# EAGLE design Zio LiPo Battery Manager (EAGLE 8.7.1)
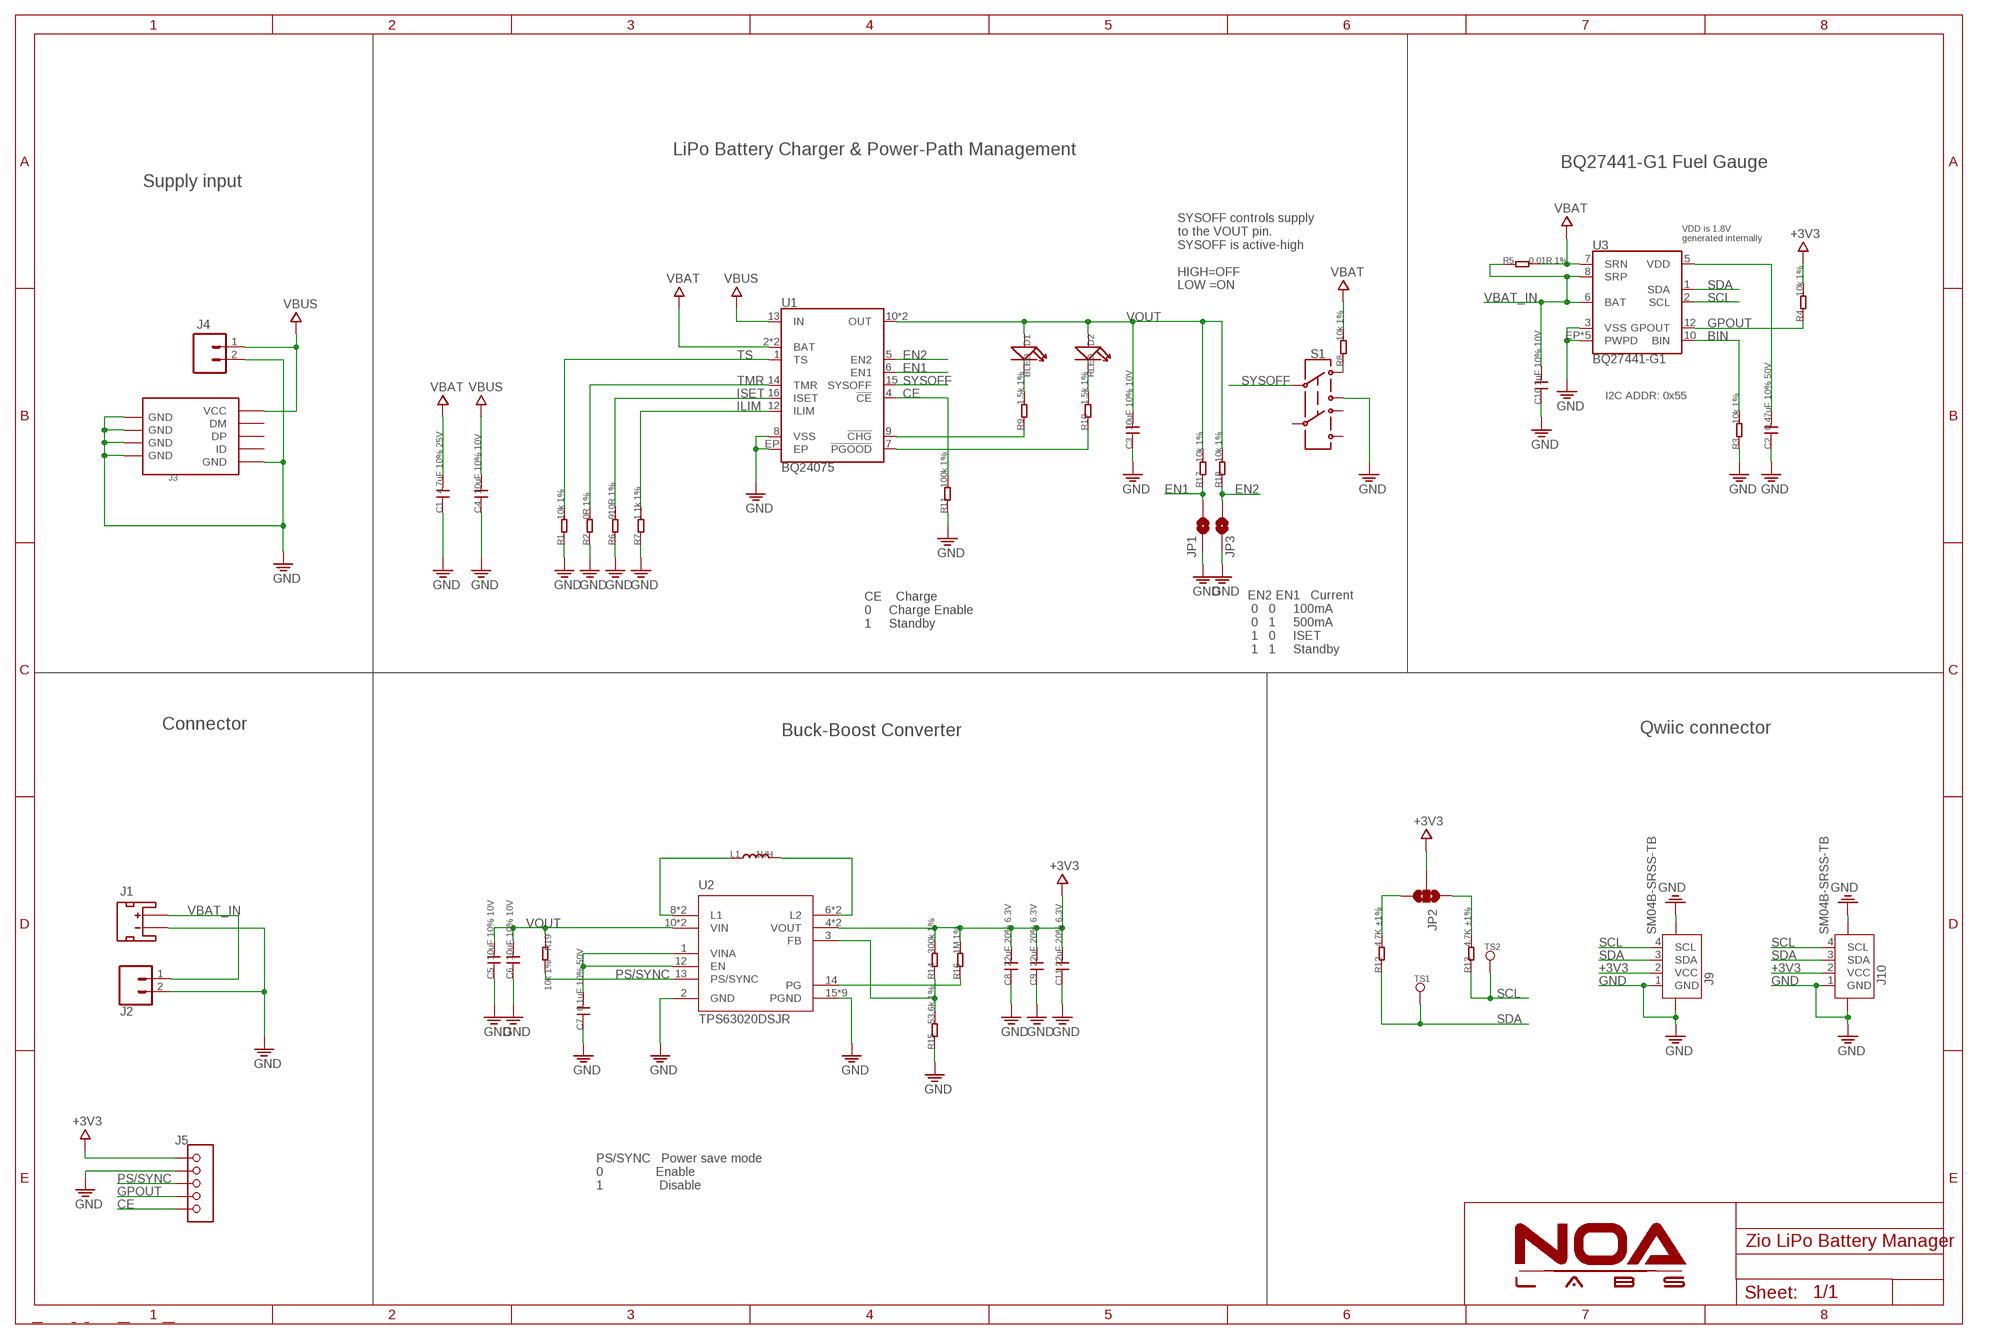
[diagram p0: schematic, sheet 1]

## Parts
C1  4.7uF 10% 25V  C-0603  [0603]
C2  0.47uF 10% 50V  C-0603  [0603]
C3  10uF 10% 10V  C-0805  [0805]
C4  10uF 10% 10V  C-0805  [0805]
C5  10uF 10% 10V  C-0805  [0805]
C6  10uF 10% 10V  C-0805  [0805]
C7  0.1uF 10% 50V  C-0603  [0603]
C8  22uF 20% 6.3V  C-0805  [0805]
C9  22uF 20% 6.3V  C-0805  [0805]
C10  1uF 10% 10V  C-0603  [0603]
C11  22uF 20% 6.3V  C-0805  [0805]
D1  BLED  LED'0603'  [LED-0603]
D2  RLED  LED'0603'  [LED-0603]
J1  JST_2MM_MALE  [JST-2-SMD]
J2  CONN_02  [1X02]
J3  USB-MICROE  [MICRO-SMD]
J4  CONN_02  [1X02]
J5  HEADER-5P-2.54  [5P-2.54]
J9  SM04B-SRSS-TB  JST-SH-4P-1.0  [JST-SH-4P]
J10  SM04B-SRSS-TB  JST-SH-4P-1.0  [JST-SH-4P]
JP1  JUMPER-SMT_2_NC_PASTE_NOCREM  [SMT-JUMPER_2_NC_PASTE_SILK_NOCREM]
JP2  JUMPER-SMT_3_2-NC_PASTE_NOCREM  [SMT-JUMPER_3_2-NC_PASTE_SILK_NOCREM]
JP3  JUMPER-SMT_2_NC_PASTE_NOCREM  [SMT-JUMPER_2_NC_PASTE_SILK_NOCREM]
L1  1UH  L-0420M  [0420M]
R1  10k 1%  R-0603  [0603]
R2  0R 1%  R-0603  [0603]
R3  10k 1%  R-0603  [0603]
R4  10k 1%  R-0603  [0603]
R5  0.01R 1%  R-1206  [1206]
R6  910R 1%  R-0603  [0603]
R7  1.1k 1%  R-0603  [0603]
R8  10k 1%  R-0603  [0603]
R9  1.5k 1%  R-0603  [0603]
R10  1.5k 1%  R-0603  [0603]
R11  100k 1%  R-0603  [0603]
R12  4.7K ±1%  R-0603  [0603]
R13  4.7K ±1%  R-0603  [0603]
R14  300k 1%  R-0603  [0603]
R15  53.6k 1%  R-0603  [0603]
R16  1M 1%  R-0603  [0603]
R17  10k 1%  R-0603  [0603]
R18  10k 1%  R-0603  [0603]
R19  10k 1%  R-0603  [0603]
S1  SWITCH-DPDT-SMD-AYZ0202  [SWITCH_DPDT_SMD_AYZ0202]
TS1  TEST_POINT35MIL  [1P-35MIL]
TS2  TEST_POINT35MIL  [1P-35MIL]
U1  BQ24075  [PVQFN-N16]
U2  TPS63020DSJR  [VSON-14]
U3  BQ27441-G1  [PDSO-N12]

## Nets
1.8V: C2.2 U3.5(VDD)
+3V3: C8.2 C9.2 C11.2 J5.1 J9.2(VCC) J10.2(VCC) JP2.2 R4.2 R14.2 R16.2 U2.4(VOUT) U2.5(VOUT)
BIN: R3.2 U3.10(BIN)
CE: J5.5 R11.2 U1.4(!CE!)
EN1: JP1.2 R17.1 U1.6(EN1)
EN2: JP3.2 R18.1 U1.5(EN2)
GND: C1.1 C2.1 C3.1 C4.1 C5.1 C6.1 C7.1 C8.1 C9.1 C10.1 C11.1 J1.1(-) J2.2 J3.GND J3.S1(GND) J3.S1@1(GND) J3.S1@2(GND) J3.S2(GND) J3.S2@1(GND) J3.S2@2(GND) J3.S3(GND) J3.S3@1(GND) J3.S3@2(GND) J3.S4(GND) J3.S4@1(GND) J3.S4@2(GND) J4.2 J5.2 J9.1(GND) J9.NC1 J9.NC2 J10.1(GND) J10.NC1 J10.NC2 JP1.1 JP3.1 R1.1 R2.1 R3.1 R6.1 R7.1 R11.1 R15.1 S1.3 U1.8(VSS) U1.EP U2.2(GND) U2.15(PGND) U2.16(PGND) U2.17(PGND) U2.18(PGND) U2.19(PGND) U2.20(PGND) U2.21(PGND) U2.22(PGND) U2.23(PGND) U3.3(VSS) U3.EP1(PWPD) U3.EP2(PWPD) U3.EP3(PWPD) U3.EP4(PWPD) U3.EP(PWPD)
GPOUT: J5.4 R4.1 U3.12(GPOUT)
ILIM: R7.2 U1.12(ILIM)
ISET: R6.2 U1.16(ISET)
N$3: JP2.3 R12.2
N$7: C7.2 U2.1(VINA) U2.12(EN)
N$8: R8.1 S1.1
N$9: R9.1 U1.9(!CHG!)
N$10: R14.1 R15.2 U2.3(FB)
N$11: D1.- R9.2
N$12: JP2.1 R13.2
N$13: R10.1 U1.7(!PGOOD!)
N$14: D2.- R10.2
N$16: L1.1 U2.8(L1) U2.9(L1)
N$18: L1.2 U2.6(L2) U2.7(L2)
PG: R16.1 U2.14(PG)
PS/SYNC: J5.3 R19.2 U2.13(PS/SYNC)
SCL: J9.4(SCL) J10.4(SCL) R13.1 TS2.P$1 U3.2(SCL)
SDA: J9.3(SDA) J10.3(SDA) R12.1 TS1.P$1 U3.1(SDA)
SYSOFF: S1.2 U1.15(SYSOFF)
TMR: R2.2 U1.14(TMR)
TS: R1.2 U1.1(TS)
VBAT: C1.2 R5.2 R8.2 U1.2(BAT) U1.3(BAT) U3.7(SRN)
VBAT_IN: C10.2 J1.2(+) J2.1 R5.1 U3.6(BAT) U3.8(SRP)
VBUS: C4.2 J3.VBUS(VCC) J4.1 U1.13(IN)
VOUT: C3.2 C5.2 C6.2 D1.+ D2.+ R17.2 R18.2 R19.1 U1.10(OUT) U1.11(OUT) U2.10(VIN) U2.11(VIN)
Unconnected: J1.NC1(PAD1) J1.NC2(PAD2) J3.D+(DP) J3.D-(DM) J3.ID S1.4 S1.5 S1.6

## Notes on the sheet
- LiPo Battery Charger & Power-Path Management
- BQ27441-G1 Fuel Gauge
- Supply input
- VDD is 1.8V
  generated internally
- SYSOFF controls supply 
  to the VOUT pin.
  SYSOFF is active-high
  
  HIGH=OFF
  LOW =ON
- I2C ADDR: 0x55
- CE    Charge
  0     Charge Enable
  1     Standby
- EN2 EN1   Current
   0   0     100mA
   0   1     500mA
   1   0     ISET
   1   1     Standby
- Connector | Qwiic connector
- Buck-Boost Converter
- PS/SYNC   Power save mode
  0               Enable
  1                Disable

## Library data of the parts
C1-C11 = Discretex:C*: Ceramic Capacitors
D1 D2 = Discretex:LED*
J1 = SparkFun-Connectors:JST_2MM_MALE: JST 2MM MALE RA CONNECTOR Two pin, compact surface mount connector. Commonly used as a battery input connection point. We really like the solid locking feeling and high current rating on these small connectors. We use these all the time as battery connectors. Mates to single-cell LiPo batteries. Here is the connector we sell at SparkFun: JST Right Angle Connector - White <https://www.sparkfun.com/products/8612> (PRT-08612) Datasheet <http://www.sparkfun.com/datasheets/Prototyping/Connectors/JST-Horizontal.pdf> It was used on these SparkFun products: SparkFun MOSFET Power Controller <https://www.sparkfun.com/products/11214> (PRT-11214) SparkFun Battery Babysitter - LiPo Battery Manager <https://www.sparkfun.com/products/13777> (PRT-13777) And many, many others that required a lipo battery connection.; DIGIKEY: https://www.digikey.com/product-detail/en/jst-sales-america-inc/S2B-PH-SM4-TB-LF-SN/455-1749-1-ND/926846; PROD_ID: CONN-11443; SF_ID: PRT-08612
J2 J4 = SparkFun-Connectors:CONN_02: Multi connection point. Often used as Generic Header-pin footprint for 0.1 inch spaced/style header connections On any of the 0.1 inch spaced packages, you can populate with these: Break Away Headers - Straight <https://www.sparkfun.com/products/116> (PRT-00116) Break Away Male Headers - Right Angle <https://www.sparkfun.com/products/553> (PRT-00553) Female Headers <https://www.sparkfun.com/products/115> (PRT-00115) Break Away Headers - Machine Pin <https://www.sparkfun.com/products/117> (PRT-00117) Break Away Female Headers - Swiss Machine Pin <https://www.sparkfun.com/products/743> (PRT-00743) For SCREWTERMINALS and SPRING TERMINALS visit here: Screw Terimnals on SparkFun.com <https://www.sparkfun.com/search/results?term=Screw+Terminals> (5mm/3.5mm/2.54mm spacing) This device is also useful as a general connection point to wire up your design to another part of your project. Our various solder wires solder well into these plated through hole pads. Hook-Up Wire - Assortment (Stranded, 22 AWG) <https://www.sparkfun.com/products/11375> (PRT-11375) Hook-Up Wire - Assortment (Solid Core, 22 AWG) <https://www.sparkfun.com/products/11367> (PRT-11367) View the entire wire category on our website here <https://www.sparkfun.com/categories/141> Special notes: Molex polarized connector foot print use with: PRT-08233 with associated crimp pins and housings. 2.54_SCREWTERM for use with PRT-10571. 3.5mm Screw Terminal footprints for PRT-08084 5mm Screw Terminal footprints for use with PRT-08432
J3 = Connector:USB-MICROE
J5 = Connector:HEADER-5P
J9 J10 = Connector:JST-SH-4P
JP1 JP3 = NOA-Jumpers:JUMPER-SMT_2_NC_PASTE_NOCREM
JP2 = NOA-Jumpers:JUMPER-SMT_3_2-NC_PASTE_NOCREM
L1 = Discretex:L*
R1-R19 = Discretex:R*
S1 = SparkFun-Switches:SWITCH-DPDT: Double-Pole, Double-Throw (DPDT) Switch Double-pole, double-throw switches. Variant Overview PTH-GPI-152-3013 Used on SparkFun Geiger Counter <https://www.sparkfun.com/products/11345> SMD-AY0202 Surface Mount DPDT Switch <https://www.sparkfun.com/products/597> (COM-00597) Used on e.g. LilyPad Arduino USB - ATmega32U4 Board <https://www.sparkfun.com/products/12049>; DIGIKEY: https://www.digikey.com/product-detail/en/c-k/AYZ0202AGRLC/401-2013-1-ND/1640122; PROD_ID: SWCH-08179; SF_SKU: COM-00597
TS1 TS2 = Connector:TEST_POINT
U1 = battery-management-temp:BQ24075; PROD_ID: IC-13219
U2 = IC:TPS63020DSJR
U3 = IC:BQ27441-G1

## Board
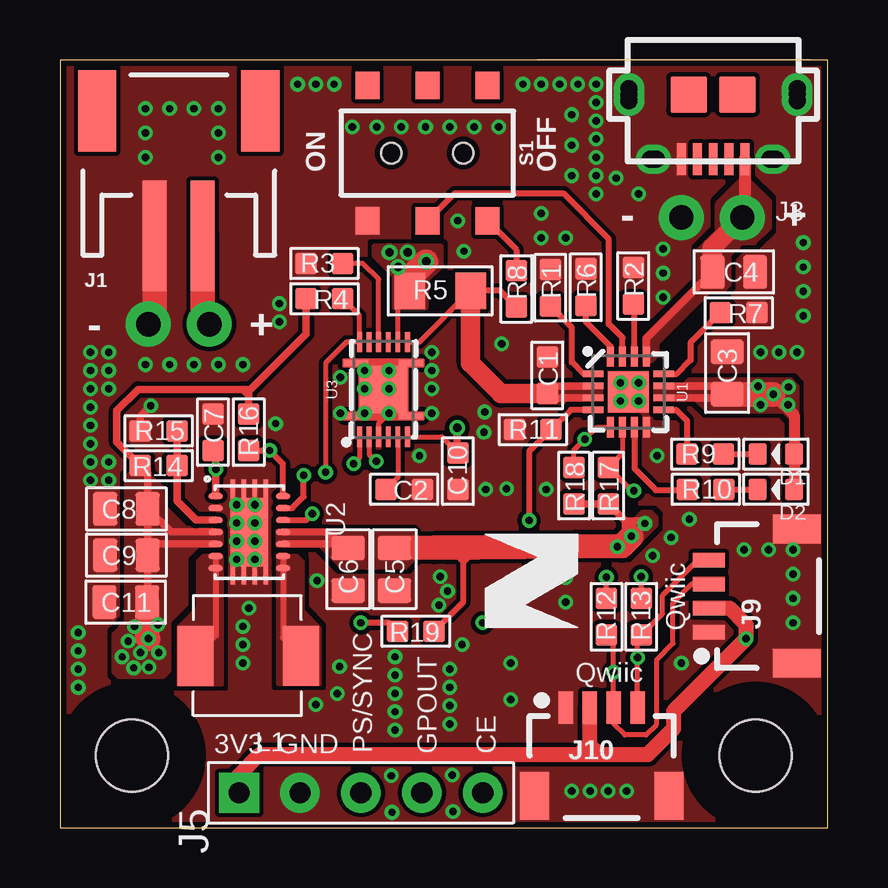
[diagram p1: board, top side]
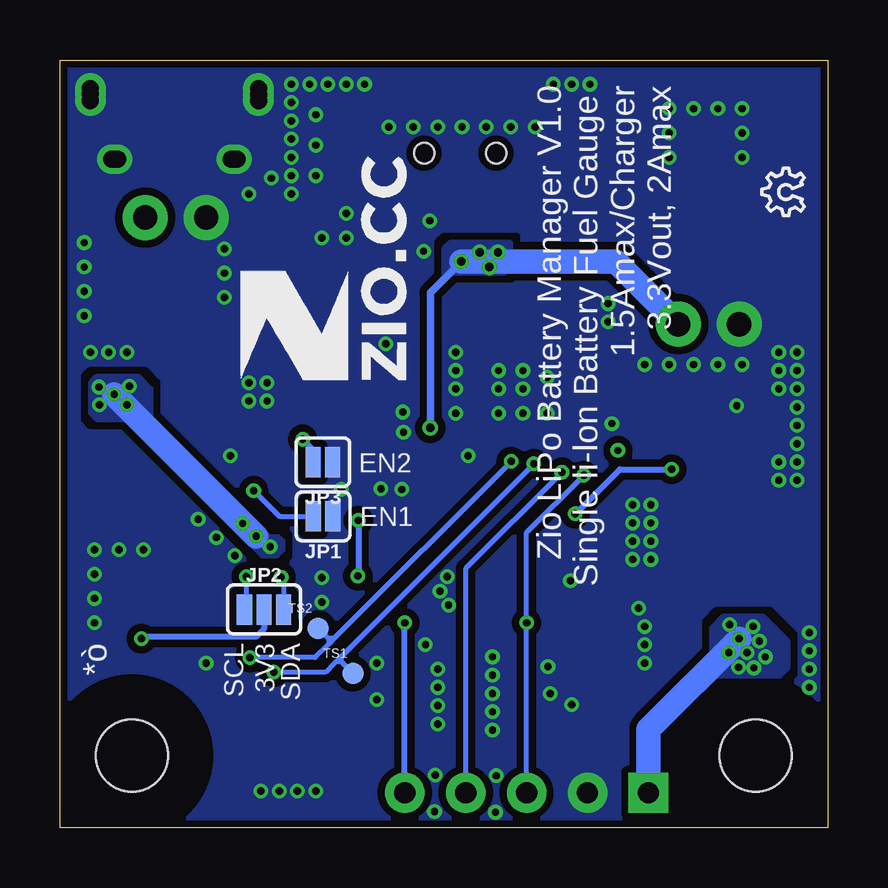
[diagram p2: board, bottom side, seen from below]

Size 32 x 32 mm. Coordinates in mm from the lower left corner, seen from the top.
Outline: 0,0 32,0 32,32 0,32 0,0
Copper layers (1*16): Top 0.035mm / dielectric 1.5mm / Bottom 0.035mm
Design rules "NOA Eagle Rule *": minimum track width 6mil, minimum drill 0.29971875mm, track to track 7mil, track to pad 7mil, pad to pad 7mil, via to via 7mil, smd to smd 0mil, copper to edge 10mil, drill to drill 10mil, minimum pad ring 10mil, minimum via ring 6mil, stop-mask expansion 2mil, vias tented up to drill 25mil, thermal gap 10mil
Holes 3 mm at 3,3 29,3
tRestrict: area 0,0 to 6,6; area 26,0 to 32,6
bRestrict: area 0,0 to 6,6; area 26,0 to 32,6

### Footprints (pad centres in the part's own frame; a part is rotated, then mirrored left to right if it is on the bottom)
0603 = smd 0.889 x 0.889: 1 -0.762,0; 2 0.762,0
0805 = smd 1.016 x 1.397: 1 -0.889,0; 2 0.889,0
LED-0603 = smd 0.762 x 0.889: + -0.762,0; - 0.762,0
JST-2-SMD = smd 1 x 4.6: 1 -1,-3.7; 2 1,-3.7 | smd 1.6 x 3.4: NC1 -3.4,1.5; NC2 3.4,1.5
1X02 = drill 1.016 pad 1.88: 1 0,0; 2 2.54,0
MICRO-SMD = smd 0.406 x 1.346: D+ 0,2.057; D- -0.66,2.057; GND 1.321,2.057; ID 0.66,2.057; VBUS -1.321,2.057 | drill 0.7: S1 -2.489,2.057; S1@1 -2.616,2.057; S1@2 -2.362,2.057; S2 2.464,2.057; S2@1 2.362,2.057; S2@2 2.616,2.057 | drill 0.7 pad 1.27: S3 -3.505,-0.66; S3@1 -3.505,-0.381; S3@2 -3.505,-0.889; S4 3.505,-0.635; S4@1 3.505,-0.381; S4@2 3.505,-0.889 | smd 1.524 x 1.524: S5 -1.016,-0.635; S6 1.016,-0.635
5P-2.54 = drill 0.889 pad 1.651 square: 1 0,5.08 | drill 0.889 pad 1.651: 2 0,2.54; 3 0,0; 4 0,-2.54; 5 0,-5.08
JST-SH-4P = smd 0.6 x 1.35: 1 1.5,0; 2 0.5,0; 3 -0.5,0; 4 -1.5,0 | smd 1.2 x 2: NC1 -2.8,3.675; NC2 2.8,3.675
SMT-JUMPER_2_NC_PASTE_SILK_NOCREM = smd 0.635 x 1.27: 1 -0.406,0; 2 0.406,0
SMT-JUMPER_3_2-NC_PASTE_SILK_NOCREM = smd 0.635 x 1.27: 1 -0.813,0; 2 0,0; 3 0.813,0
0420M = smd 1.5 x 2.5: 1 0,0; 2 4.4,0
1206 = smd 1.27 x 1.524: 1 -1.27,0; 2 1.27,0
SWITCH_DPDT_SMD_AYZ0202 = smd 1 x 1.15: 1 -2.5,2.825; 2 0,2.825; 3 2.5,2.825; 4 -2.5,-2.825; 5 0,-2.825; 6 2.5,-2.825 | hole 0.85: 1.5,0; -1.5,0
1P-35MIL = smd 0.889 x 0.889: P$1 0,0
PVQFN-N16 = smd 0.28 x 0.85: 1 -0.75,-1.475; 2 -0.25,-1.475; 3 0.25,-1.475; 4 0.75,-1.475; 9 0.75,1.475; 10 0.25,1.475; 11 -0.25,1.475; 12 -0.75,1.475 | smd 0.85 x 0.28: 5 1.475,-0.75; 6 1.475,-0.25; 7 1.475,0.25; 8 1.475,0.75; 13 -1.475,0.75; 14 -1.475,0.25; 15 -1.475,-0.25; 16 -1.475,-0.75 | smd 1.7 x 1.7: EP 0,0
VSON-14 = smd 0.24 x 0.6: 1 -1.5,-1.4; 2 -1,-1.4; 3 -0.5,-1.4; 4 0,-1.4; 5 0.5,-1.4; 6 1,-1.4; 7 1.5,-1.4; 8 1.5,1.4; 9 1,1.4; 10 0.5,1.4; 11 0,1.4; 12 -0.5,1.4; 13 -1,1.4; 14 -1.5,1.4 | smd 2.85 x 1.58: 15 0,0 | smd 0.775 x 0.2: 16 -1.8,0.69; 17 -1.8,0.23; 18 -1.8,-0.23; 19 -1.8,-0.69; 20 1.8,-0.69; 21 1.8,-0.23; 22 1.8,0.23; 23 1.8,0.69
PDSO-N12 = smd 0.2 x 0.85: 1 -1,-1.975; 2 -0.6,-1.975; 3 -0.2,-1.975; 4 0.2,-1.975; 5 0.6,-1.975; 6 1,-1.975; 7 1,1.975; 8 0.6,1.975; 9 0.2,1.975; 10 -0.2,1.975; 11 -0.6,1.975; 12 -1,1.975 | smd 1.95 x 1.95: EP 0,0 | smd 1 x 0.25: EP1 -1.15,1.1; EP2 -1.15,-1.1; EP3 1.15,-1.1; EP4 1.15,1.1

### Placement (x,y rotation side)
C1  20.32,18.85 270 top
C2  14.35,14.1 180 top
C3  27.81,18.95 270 top
C4  28.09,23.16 180 top
C5  13.94,10.77 90 top
C6  12.01,10.77 90 top
C7  6.38,16.48 270 top
C8  2.77,13.28 0 top
C9  2.77,11.35 0 top
C10  16.59,14.86 90 top
C11  2.74,9.4 0 top
D1  29.84,15.57 180 top
D2  29.84,14.1 180 top
J1  4.95,28.37 0 top
J2  6.22,20.99 180 top
J3  27.23,29.92 180 top
J4  28.45,25.43 180 top
J5  12.55,1.45 90 top
J9  27.05,9.65 270 top
J10  22.58,5 180 top
JP1  21.03,12.97 180 bottom
JP2  23.5,9.09 0 bottom
JP3  21.04,15.23 180 bottom
L1  10.06,7.16 180 top
LOGO1  LOGO-OSHW-6MILX0070-NT  [OSHW_6X70_NOTEXT]  0.96,25.5 90 bottom
R1  20.45,22.5 270 top
R2  23.9,22.58 270 top
R3  11.02,23.52 0 top
R4  11.02,22.05 180 top
R5  15.85,22.38 0 top
R6  21.92,22.53 270 top
R7  28.3,21.46 180 top
R8  19.02,22.45 270 top
R9  26.9,15.57 0 top
R10  26.92,14.1 0 top
R11  19.71,16.59 0 top
R12  22.78,8.79 90 top
R13  24.23,8.79 90 top
R14  4.11,15.09 180 top
R15  4.11,16.54 0 top
R16  7.87,16.48 90 top
R17  22.86,14.25 270 top
R18  21.44,14.25 270 top
R19  14.83,8.18 180 top
S1  15.32,28.12 180 top
TS1  19.79,6.43 0 bottom
TS2  21.23,8.31 0 bottom
U1  23.7,18.16 270 top
U2  7.9,12.32 270 top
U3  13.49,18.26 0 top
U$1  [7MM]  17.58,18.67 90 bottom
U$2  [6MM]  17.7,8.31 0 top

### Tracks (layer width: path | path; a pad name or v marks a point on that pad's centre or on a via)
1.8V
  Top 0.203: U3.5 14.09,14.6 C2.2
+3V3  (via drill 0.3)
  Top 0.305: R4.2 10.26,20.57 7.95,18.26 7.87,18.26 | C8.2 3.66,14.78 R14.2 2.38,16.07 2.38,17.39 3.25,18.26 7.62,18.26 7.64,18.26 | 7.64,18.26 7.87,18.26 | U2.4 4.63,12.32 C8.2 | U2.5 4.12,11.82 C9.2 | C8.2 C9.2 | C9.2 3.66,9.42 C11.2 | R16.2 7.87,18.03 | 7.87,18.03 7.87,18.26 | 7.87,18.03 7.64,18.26
  Top 0.635: 21.67,3.05 8.33,3.05 7.47,2.18 J5.1 | 21.67,3.05 22.05,3.05 | 22.05,3.05 22.48,3.05 | 22.48,3.05 24.51,3.05 25.59,4.13 25.59,4.86 v28.6,7.87 28.6,8.46 27.91,9.15 J9.2 | 22.05,3.05 22.08,3.08 22.08,3.45 | J10.2 22.08,3.46 | 22.08,3.46 21.67,3.05 | 22.08,3.46 22.08,3.45 | 22.08,3.45 22.48,3.05
  Top 1.016: v3.68,7.87 3.63,7.92 C11.2
  Bottom 0.254: JP2.2 23.5,8.28 23.82,7.95 28.52,7.95 v28.6,7.87
  Bottom 1.016: J5.1 7.47,4.09 v3.68,7.87
  other vias: 3.1,8.38 4.09,8.46 4.11,7.29 3.71,6.68 3.35,7.29 2.84,7.77 2.59,7.11 3.07,6.65
  pour Top (no thermals): 6.58,12.47 5.23,12.47 4.37,13.34 4.32,13.39 4.32,14.07 3.58,14.81 3,14.81 2.77,14.58 2.77,9.07 2.77,8.59 2.24,8.05 2.24,6.5 2.44,6.3 4.29,6.3 4.55,6.55 4.55,8.61 5.26,9.32 5.26,11.28 5.71,11.73 5.77,11.79 6.5,11.79 6.65,11.79 6.73,11.86 6.73,12.32
  pour Bottom (no thermals): 2.39,6.3 4.72,6.3 4.83,6.4 4.83,8.33 4.34,8.81 2.69,8.81 2.13,8.26 2.06,8.18 1.65,7.77 1.65,7.06 1.65,6.65 1.85,6.45 2.01,6.3
BIN
  Top 0.203: R3.2 12.62,23.52 13.29,22.86 U3.10
CE  (via drill 0.3)
  Top 0.254: U1.4 21.3,17.41 R11.2 19.56,15.67 v19.56,12.8 | v17.63,8.53 v19.58,10.49
  Bottom 0.254: J5.5 v17.63,8.53 | v19.56,12.8 19.56,10.52 v19.58,10.49
EN1  (via drill 0.3)
  Top 0.203: U1.6 23.45,15.6 R17.1 23.83,14.05 v23.93,14.05
  Bottom 0.203: v23.93,14.05 22.85,12.97 JP1.2
EN2  (via drill 0.3)
  Top 0.203: U1.5 22.38,16.69 v21.88,16.19 21.44,15.75 R18.1
  Bottom 0.203: v21.88,16.19 21.45,15.76 JP3.2
GND  (via drill 0.3)
  Top 0.203: U3.3 13.29,16.84 v13.72,17.27
  Top 0.305: R15.1 3.35,17.14 v3.79,17.58
  Top 1.016: J1.1 3.95,21.26 J2.2
  Bottom 0.813: 3.68,20.45 J2.2
  other vias: 20.07,24.59 21.08,24.59 16.84,24.03 23.19,27.08 24.89,15.49 25.91,6.86 21.08,10.41 21.08,9.4 18.8,6.86 18.8,5.33 16.26,5.08 13.97,5.59 13.97,4.83 13.97,4.06 14.99,15.49 12.7,17.27 12.7,18.29 11.68,18.77 11.68,17.27 8.99,16.84 7.62,19.3 7.37,11.18 7.37,11.94 7.37,12.7 7.37,13.46 7.87,9.14 10.72,10.29 11.56,5.59 23.37,18.54 24.13,17.78 24.13,18.54 23.37,17.78 25.15,22.1 25.15,23.11 25.15,24.13 29.21,19.81 29.97,19.81 30.73,19.81 21.34,1.52 22.1,1.52 22.86,1.52 23.62,1.52 2.03,19.81 2.03,19.05 2.03,18.29 1.27,19.81 1.27,19.05 1.27,18.29 3.56,27.94 3.56,28.96 3.56,29.97 4.57,29.97 5.59,29.97 6.6,29.97 19.3,30.99 20.07,30.99 20.83,30.99 21.59,30.99 22.35,30.99 9.91,30.99 10.67,30.99 11.43,30.99 30.99,24.38 30.99,23.37 30.99,22.35 30.99,21.34 8.13,13.46 8.13,12.7 8.13,11.94 8.13,11.18 20.27,14.1 18.41,20.17 17.75,14.1 18.62,14.12 30.56,11.58 30.56,10.57 30.56,9.55 30.56,8.53 29.54,11.58 28.52,11.58 13.72,18.29 13.72,19.05 12.7,19.05 15.49,19.05 15.49,17.27 9.14,21.08 9.14,21.84 16.59,25.3 17.7,17.32 17.68,16.48 6.6,19.3 5.59,19.3 4.57,19.3 3.56,19.3 6.6,28.96 6.6,27.94 15.49,19.81 15.49,18.29 18.29,29.21 17.27,29.21 16.26,29.21 15.24,29.21 14.22,29.21 13.21,29.21 12.19,29.21 22.35,30.23 22.35,29.46 22.35,28.7 22.35,27.94 22.35,27.18 22.35,26.42 24.13,26.42 21.34,29.72 21.34,28.45 21.34,27.18 26.24,12.85 25.48,12.09 24.71,11.33 20.07,25.6 10.67,5.13 11.66,6.71 15.85,10.46 15.8,9.27 16.15,9.86 16.26,4.32 16.26,5.84 16.26,6.6 16.76,7.62 13.97,6.35 13.97,7.11 1.27,17.53 1.27,16.76 1.27,16 1.27,15.24 1.27,14.48 2.03,14.48 2.03,15.24 0.76,8.13 0.76,7.37 0.76,6.6 0.76,5.84 7.62,8.38 7.62,7.62 7.62,6.86 16.36,2.18 13.82,2.16 16.38,0.66 13.84,0.64
  pour Bottom (isolate 0.305, rank 2, no thermals): 0,32 0,0 32,0 32,32
  pour Top (rank 2, no thermals): -0.05,32.05 32,32.05 32,0 -0.05,0
GPOUT  (via drill 0.3)
  Top 0.203: 12.19,20.24 U3.12 12.49,21.34 R4.1 | 12.19,20.24 11.94,20.24 11.07,19.37 v11.07,14.81 | 12.19,20.24
  Bottom 0.203: v11.07,14.81 15.09,10.79 J5.4
ILIM
  Top 0.254: U1.12 25.72,18.91 26.29,19.48 26.29,20.22 R7.2
ISET
  Top 0.254: U1.16 22.95,20.05 21.92,21.08 R6.2
N$3  (via drill 0.3)
  Top 0.203: R12.2 v22.78,10.44
  Bottom 0.203: v22.78,10.44 22.68,10.34 JP2.3
N$7  (via drill 0.3)
  Top 0.254: 9.65,12.82 U2.12 10.25,12.82 v10.52,13.08
  Top 0.305: U2.1 v6.5,14.94 6.5,15.6 C7.2
  Bottom 0.254: v10.52,13.08 8.66,14.94 v6.5,14.94
N$8
  Top 0.254: S1.1 19.02,24.08 R8.1
N$9
  Top 0.254: U1.9 25.69,17.41 26.14,16.97 R9.1
N$10
  Top 0.305: U2.3 5.68,12.82 4.88,13.61 R14.1 R15.2
N$11
  Top 0.254: R9.2 D1.-
N$12  (via drill 0.3)
  Top 0.203: R13.2 v24.23,10.46
  Bottom 0.203: v24.23,10.46 24.23,9.17 JP2.1
N$13
  Top 0.254: U1.7 23.95,14.96 24.84,14.07 26.14,14.07 R10.1
N$14
  Top 0.254: R10.2 D2.-
N$16
  Top 0.254: U2.9 U2.8 9.3,7.92 L1.1
  pour Top (no thermals): 9.07,11.35 9.88,11.35 10.13,11.1 10.13,9.04 10.85,8.33 10.85,5.97 9.09,5.97 9.07,5.99
N$18
  Top 0.254: U2.6 U2.7 6.5,8 L1.2
  pour Top (no thermals): 6.68,11.35 5.97,11.35 5.84,11.23 5.74,11.13 5.74,9.17 4.93,8.36 4.93,5.94 6.76,5.94 6.76,11.28
PG  (via drill 0.3)
  Top 0.254: U2.14 9.3,15.16 v8.74,15.72 R16.1
PS/SYNC  (via drill 0.3)
  Top 0.254: U2.13 9.68,13.32 10.16,13.79 v10.16,14.68 | R19.2 13.72,8.53 v12.55,8.53
  Bottom 0.203: J5.3 v12.55,8.53 12.55,12.29 v10.16,14.68
SCL  (via drill 0.3)
  Top 0.203: J10.4 v24.08,7.09 24.08,7.88 | 24.08,7.88 R13.1 25.12,8.91 25.12,9.68 26.59,11.15 J9.4 | 24.56,7.88 24.08,7.88 | U3.2 12.89,15.56 v13.18,15.27
  Bottom 0.203: v13.18,15.27 20.55,7.9 | 20.55,7.9 20.8,7.64 | 20.8,7.64 21.36,7.09 v24.08,7.09 | TS2.P$1 20.83,7.9 | 20.83,7.9 20.55,7.9 | 20.83,7.9 20.8,7.87 20.8,7.64
SDA  (via drill 0.3)
  Top 0.203: R12.1 23.08,7.73 v23.08,6.48 J10.3 23.08,4.33 23.55,3.86 24.43,3.86 24.88,4.3 24.88,7 25.55,7.67 25.55,9.37 26.33,10.15 J9.3 | U3.1 12.49,15.41 v12.24,15.16
  Bottom 0.203: v12.24,15.16 20.27,7.14 | 20.27,7.14 20.5,6.91 | v23.08,6.48 20.93,6.48 20.55,6.86 20.5,6.91 | TS1.P$1 20.27,6.91 | 20.27,6.91 20.27,7.14 | 20.27,6.91 20.5,6.91
SYSOFF
  Top 0.254: U1.15 23.45,20.42 22.89,20.98 22.89,24.54 20.98,26.44 16.46,26.44 S1.2
TMR
  Top 0.254: U1.14 23.95,21.77 R2.2
TS
  Top 0.254: U1.1 21.83,18.91 21.34,19.41 21.34,20.85 R1.2
VBAT
  Top 0.203: U3.7 14.98,20.24 R5.2
  Top 0.254: R8.2 18.34,22.38 R5.2
  Top 0.305: U1.2 20.65,18.41 C1.2 | U1.3 20.49,17.91
  Top 0.457: 20.49,17.91 C1.2
  Top 0.813: C1.2 18.39,18.09 17.12,19.36 R5.2
  pour Top (no thermals): 22.58,18.49 19.94,18.49 19.86,18.41 19.86,17.88 19.91,17.83 20.04,17.7 20.78,17.7 20.98,17.7 21.03,17.75 21.11,17.83 22.58,17.83
VBAT_IN  (via drill 0.35)
  Top 0.203: U3.8 14.09,21.89 R5.1 | U3.6 15.92,16.29 C10.2
  Top 0.305: v16.56,16.66 16.56,15.65 C10.2
  Top 1.016: J1.2 5.95,21.26 J2.1 | v15.27,23.6 14.58,22.91 R5.1
  Bottom 0.305: v15.27,23.6 16.56,22.3 v16.56,16.66
  Bottom 1.016: J2.1 8.83,23.6 v15.27,23.6
  other vias: 14.5,23.98 13.74,23.98 14.1,23.37
  pour Top (no thermals): 13.94,21.67 13.94,22.99 13.11,23.83 13.11,24.26 15.88,24.26 15.88,23.39 15.27,22.78 15.27,21.67
  pour Bottom (no thermals): 13.21,24.38 15.75,24.38 16,24.13 16,23.11 13.46,23.11 13.21,23.37
VBUS
  Top 0.305: U1.13 24.45,20.41 C4.2
  Top 0.457: 28.49,25.48 J4.1 28.55,25.53
  Top 0.508: J3.VBUS 28.55,25.53
  Top 0.813: C4.2 27.2,24.19 J4.1
  pour Top (no thermals): 24.38,19.46 24.38,20.42 26.62,22.66 26.62,24.05 27.41,24.84 27.41,26.01 28.37,26.97 28.73,26.97 29.57,26.14 29.57,25.12 29.57,24.99 28.93,24.36 28.4,24.36 27.91,23.88 27.89,23.85 27.89,22.63 27.64,22.38 27.08,22.38 24.89,20.19 24.89,19.71 24.64,19.46
VOUT  (via drill 0.3)
  Top 0.254: 16.81,11.07 16.81,11.68 | R19.1 16.81,9.4 16.81,11.02 16.81,11.07 | 16.81,11.07 16.2,11.68 | 16.81,11.07 16.81,11.08 17.42,11.69
  Top 0.305: U1.11 27.46,18.41 C3.2 | U1.10 27.66,17.91 | U2.11 11.08,12.32 C6.2 11.58,11.82 U2.10 | R18.2 R17.2 23.57,12.78 | 23.57,12.78 24.28,12.78 v24.38,12.68 | 23.57,12.78 23.57,12.39 v23.82,12.14
  Top 0.457: 27.66,17.91 C3.2 | v29.74,18.06 30.61,17.2 D1.+ D2.+
  Top 1.016: C3.2 v29.74,18.06 | v23.82,12.14 23.42,11.73 17.42,11.69 16.81,11.68 16.2,11.68 15.62,11.67 C5.2
  Bottom 1.016: v29.74,18.06 v23.82,12.14
  other vias: 29.21,17.63 29.11,18.39 30.38,18.36 30.35,17.63 23.24,11.71
  pour Top (no thermals): 9.04,11.73 9.04,12.4 14.66,12.4 14.81,12.24 14.81,11.2 14.71,11.1 14.43,10.82 11.73,10.82 10.82,11.73
  pour Top (no thermals): 24.79,18.47 24.79,17.83 26.49,17.83 27,17.32 30.15,17.32 30.38,17.09 30.76,17.09 30.76,18.41 30.48,18.69 26.21,18.69 26.11,18.59 25.98,18.47
  pour Top (no thermals): 22.91,12.14 23.22,12.14 24.26,13.18 24.66,13.18 24.89,12.95 24.89,12.6 23.6,11.3 22.83,11.3 22.66,11.48 22.66,11.89
  pour Bottom (no thermals): 24.38,13.31 23.24,12.17 22.89,12.17 22.68,11.96 22.68,11.56 22.94,11.3 23.6,11.3 24.97,12.67 24.97,12.93 24.59,13.31
  pour Bottom (no thermals): 30.23,18.8 30.48,18.8 30.73,18.54 30.73,17.27 30.48,17.02 28.19,17.02 28.19,18.29 28.7,18.8

### Text on the board
tPlace: ON | OFF | - | + | - | + | Qwiic | Qwiic | 3V3 | GND | PS/SYNC | GPOUT | CE
bPlace: Zio LiPo Battery Manager V1.0 / Single li-lon Battery Fuel Gauge / 1.5Amax/Charger / 3.3Vout, 2Amax | EN2 | EN1 | SDA | 3V3 | SCL | *ò